# Altium schematic sheet Filters.3.SchDoc
size A; SheetNumber: 2; SheetTotal: 3
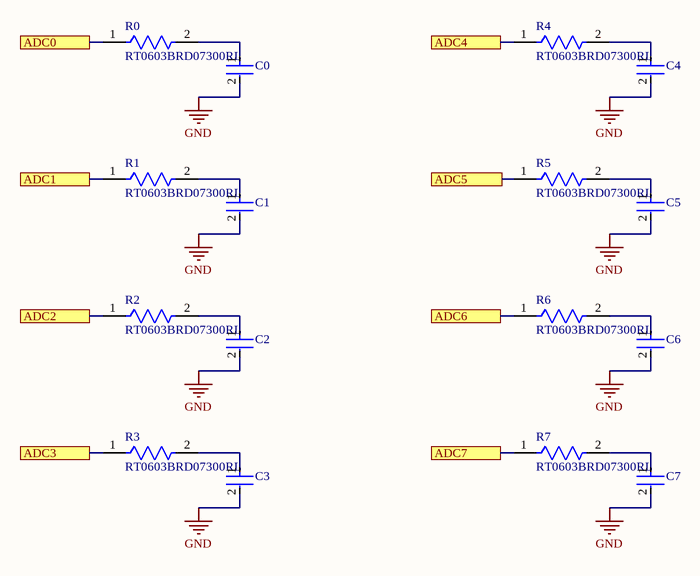
[diagram p0: Filters.3.SchDoc]

## Parts
C0  C0603C104M4RAC  [FP-C0603C-CF-MFG]  (value not drawn)
C1  C0603C104M4RAC  [FP-C0603C-CF-MFG]  (value not drawn)
C2  C0603C104M4RAC  [FP-C0603C-CF-MFG]  (value not drawn)
C3  C0603C104M4RAC  [FP-C0603C-CF-MFG]  (value not drawn)
C4  C0603C104M4RAC  [FP-C0603C-CF-MFG]  (value not drawn)
C5  C0603C104M4RAC  [FP-C0603C-CF-MFG]  (value not drawn)
C6  C0603C104M4RAC  [FP-C0603C-CF-MFG]  (value not drawn)
C7  C0603C104M4RAC  [FP-C0603C-CF-MFG]  (value not drawn)
R0  RT0603BRD07300RL  [FP-RT0603-MFG]
R1  RT0603BRD07300RL  [FP-RT0603-MFG]
R2  RT0603BRD07300RL  [FP-RT0603-MFG]
R3  RT0603BRD07300RL  [FP-RT0603-MFG]
R4  RT0603BRD07300RL  [FP-RT0603-MFG]
R5  RT0603BRD07300RL  [FP-RT0603-MFG]
R6  RT0603BRD07300RL  [FP-RT0603-MFG]
R7  RT0603BRD07300RL  [FP-RT0603-MFG]

## Ports
ADC0 (see 48PinConnector[4A], MainSchematic.3[2B]), ADC1 (see 48PinConnector[4A], MainSchematic.3[2C]), ADC2 (see 48PinConnector[4A], MainSchematic.3[2C]), ADC3 (see 48PinConnector[4A], MainSchematic.3[2C]), ADC4 (see 48PinConnector[4A], MainSchematic.3[2C]), ADC5 (see 48PinConnector[4A], MainSchematic.3[2C]), ADC6 (see 48PinConnector[4A], MainSchematic.3[2C]), ADC7 (see 48PinConnector[4B], MainSchematic.3[2C])

## Nets
GND: C0.2 C1.2 C2.2 C3.2 C4.2 C5.2 C6.2 C7.2
ADC0: R0.1 ; port ADC0
ADC1: R1.1 ; port ADC1
ADC2: R2.1 ; port ADC2
ADC3: R3.1 ; port ADC3
ADC4: R4.1 ; port ADC4
ADC5: R5.1 ; port ADC5
ADC6: R6.1 ; port ADC6
ADC7: R7.1 ; port ADC7
NetC0_1: C0.1 R0.2
NetC1_1: C1.1 R1.2
NetC2_1: C2.1 R2.2
NetC3_1: C3.1 R3.2
NetC4_1: C4.1 R4.2
NetC5_1: C5.1 R5.2
NetC6_1: C6.1 R6.2
NetC7_1: C7.1 R7.2

## Library data of the parts
C0-C7 = CMP-03020-019612-2: C0603 0.10 μF X7R 30ppm/°C 20.00% 16 V; Manufacturer: KEMET; Voltage Rating: 16 V; Tolerance: 0.2; Automotive Grade: Grade 1; Material: Ceramic; Value: 0.10 μF; Device Class L3: Ceramic Capacitors; Height: 0.87mm; Octopart: https://octopart.com/c0603c104m4rac-kemet-1325405; Temperature Coefficient: 30ppm/°C; Manufacturer Part Number: C0603C104M4RAC; ComponentLink2Description: Datasheet; Temperature Range High: +125°C; Mouser Description: Ceramic Multilayer Capacitor; Capacitor Type: General Purpose; Capacitance: 0.1uF; Capacitance Tolerance: +/- 20%;...; Temperature Range Low: -55°C; Temperature: -55°C to +125°C; Temperature Characteristic: X7R; RoHS: TRUE; Device Class L1: Passive Components; Automotive: Yes; Capacitance: 0.10 μF; Lead Free: Yes; ComponentLink2URL: https://api.kemet.com/component-edge/download/datasheet/C0603C100J5GACAUTO.pdf; Device Class L2: Capacitors; Package: C0603C-CF; Category: Cap
R0-R7 = CMP-2000-04432-2: RES SMD 300 OHM 0.1% 1/10W 0603; Manufacturer: Yageo; Voltage Rating: 75V; Temperature Coefficient: 25 ppm/°C; Tolerance: 0.001; Value: 300Ω; Power Rating: 0.1W; Description: RT0603 300Ω 0.1W 25 ppm/°C 0.10%; Category: Res; Temperature Range High: +155°C; Composition: Thin Film; Lead Free: Yes; Height: 0.55mm; RoHS: TRUE; Temperature Range Low: -55°C; Octopart: https://octopart.com/rt0603brd07300rl-yageo-1463297; Mouser Description: Thin Film Resistors - SMD 1/10W 300 ohm .1% 25ppm; Series: RT; Package: RT0603; Digikey Description: RES SMD 300 OHM 0.1% 1/10W 0603; Device Class L3: Chip SMD Resistors; ComponentLink2URL: http://www.yageo.com/documents/recent/PYu-RT_1-to-0.01_RoHS_L_9.pdf; Manufacturer Part Number: RT0603BRD07300RL; Device Class L1: Passive Components; Automotive: No; Footprint Url: http://www.yageo.com/exep/pages/download/literatures/PYu-R_Mount_10.pdf; Device Class L2: Resistors; Temperature: -55°C to +155°C; ComponentLink2Description: Datasheet; Ipc Land Pattern Name: RESC16080X45; Resistance: 300Ω